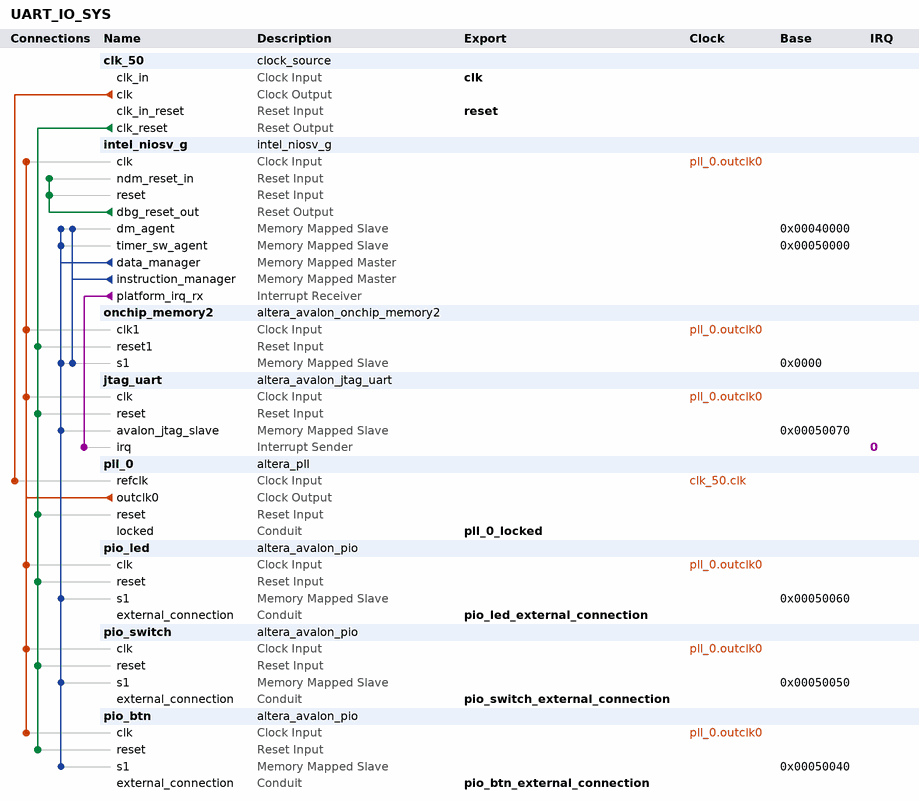
[diagram p0: system contents]
# Platform Designer (Qsys) system UART_IO_SYS, Cyclone V 5CSEBA6U23I7
# Parameters at their usual value, and those the tool derives, are not listed.
package require -exact qsys 25.1
create_system UART_IO_SYS
set_project_property DEVICE_FAMILY {Cyclone V}
set_project_property DEVICE 5CSEBA6U23I7

add_instance clk_50 clock_source 25.1
set_instance_parameter_value clk_50 clockFrequency 50000000

add_instance intel_niosv_g intel_niosv_g 4.0.0
set_instance_parameter_value intel_niosv_g Blind_Window_Period 1000
set_instance_parameter_value intel_niosv_g CLICenabledInterruptMode 0
set_instance_parameter_value intel_niosv_g CLICenabledShadowRegisterFiles 1
set_instance_parameter_value intel_niosv_g Default_Timeout_Period 255
set_instance_parameter_value intel_niosv_g alignCLICVectorTable 8
set_instance_parameter_value intel_niosv_g basicInterruptMode 0
set_instance_parameter_value intel_niosv_g basicShadowRegisterFiles 0
set_instance_parameter_value intel_niosv_g clockFrequency 100000000
set_instance_parameter_value intel_niosv_g dataCacheSize 4096
set_instance_parameter_value intel_niosv_g disableFsqrtFdiv false
set_instance_parameter_value intel_niosv_g dtcm1Base 0
set_instance_parameter_value intel_niosv_g dtcm1Size 0
set_instance_parameter_value intel_niosv_g dtcm2Base 0
set_instance_parameter_value intel_niosv_g dtcm2Size 0
set_instance_parameter_value intel_niosv_g enableBranchPrediction true
set_instance_parameter_value intel_niosv_g enableCLICInterruptEdgeTriggerConfig false
set_instance_parameter_value intel_niosv_g enableCLICInterruptPolarityConfig false
set_instance_parameter_value intel_niosv_g enableCLICSelectiveHardwareVectoring false
set_instance_parameter_value intel_niosv_g enableCoreLevelInterruptController false
set_instance_parameter_value intel_niosv_g enableDebug true
set_instance_parameter_value intel_niosv_g enableDebugReset true
set_instance_parameter_value intel_niosv_g enableECCFull false
set_instance_parameter_value intel_niosv_g enableECCLite false
set_instance_parameter_value intel_niosv_g enableFPU false
set_instance_parameter_value intel_niosv_g enableLockstep false
set_instance_parameter_value intel_niosv_g enableLockstepExtRst false
set_instance_parameter_value intel_niosv_g enableMulDiv true
set_instance_parameter_value intel_niosv_g hartId 0
set_instance_parameter_value intel_niosv_g instCacheSize 4096
set_instance_parameter_value intel_niosv_g itcm1Base 0
set_instance_parameter_value intel_niosv_g itcm1Size 0
set_instance_parameter_value intel_niosv_g itcm2Base 0
set_instance_parameter_value intel_niosv_g itcm2Size 0
set_instance_parameter_value intel_niosv_g numCLICDebugTriggers 0
set_instance_parameter_value intel_niosv_g numCLICLevels 2
set_instance_parameter_value intel_niosv_g numCLICPlatformInterrupts 16
set_instance_parameter_value intel_niosv_g numCLICPriorities 8
set_instance_parameter_value intel_niosv_g peripheralRegionABase 327680
set_instance_parameter_value intel_niosv_g peripheralRegionASize 65536
set_instance_parameter_value intel_niosv_g peripheralRegionBBase 0
set_instance_parameter_value intel_niosv_g peripheralRegionBSize 0
set_instance_parameter_value intel_niosv_g resetOffset 0
set_instance_parameter_value intel_niosv_g resetSlave onchip_memory2.s1
set_instance_parameter_value intel_niosv_g useResetReq false

add_instance onchip_memory2 altera_avalon_onchip_memory2 25.1
set_instance_parameter_value onchip_memory2 dataWidth 32
set_instance_parameter_value onchip_memory2 dualPort false
set_instance_parameter_value onchip_memory2 initMemContent true
set_instance_parameter_value onchip_memory2 initializationFileName onchip_mem.hex
set_instance_parameter_value onchip_memory2 memorySize 160000

add_instance jtag_uart altera_avalon_jtag_uart 25.1
set_instance_parameter_value jtag_uart simInteractiveOptions NO_INTERACTIVE_WINDOWS

add_instance pll_0 altera_pll 25.1
set_instance_parameter_value pll_0 gui_device_speed_grade 1
set_instance_parameter_value pll_0 gui_number_of_clocks 1
set_instance_parameter_value pll_0 gui_operation_mode direct
set_instance_parameter_value pll_0 gui_output_clock_frequency0 100.0
set_instance_parameter_value pll_0 gui_pll_mode {Integer-N PLL}
set_instance_parameter_value pll_0 gui_reference_clock_frequency 50.0
set_instance_parameter_value pll_0 gui_use_locked true

add_instance pio_led altera_avalon_pio 25.1
set_instance_parameter_value pio_led direction Output
set_instance_parameter_value pio_led width 8

add_instance pio_switch altera_avalon_pio 25.1
set_instance_parameter_value pio_switch direction Input
set_instance_parameter_value pio_switch width 3

add_instance pio_btn altera_avalon_pio 25.1
set_instance_parameter_value pio_btn direction Input
set_instance_parameter_value pio_btn width 2

# connections
add_connection clk_50.clk pll_0.refclk clock
add_connection pll_0.outclk0 intel_niosv_g.clk clock
add_connection pll_0.outclk0 jtag_uart.clk clock
add_connection pll_0.outclk0 onchip_memory2.clk1 clock
add_connection pll_0.outclk0 pio_btn.clk clock
add_connection pll_0.outclk0 pio_led.clk clock
add_connection pll_0.outclk0 pio_switch.clk clock
add_connection clk_50.clk_reset jtag_uart.reset reset
add_connection clk_50.clk_reset onchip_memory2.reset1 reset
add_connection clk_50.clk_reset pio_btn.reset reset
add_connection clk_50.clk_reset pio_led.reset reset
add_connection clk_50.clk_reset pio_switch.reset reset
add_connection clk_50.clk_reset pll_0.reset reset
add_connection intel_niosv_g.dbg_reset_out intel_niosv_g.ndm_reset_in reset
add_connection intel_niosv_g.dbg_reset_out intel_niosv_g.reset reset
add_connection intel_niosv_g.data_manager intel_niosv_g.dm_agent avalon
set_connection_parameter_value intel_niosv_g.data_manager/intel_niosv_g.dm_agent baseAddress 0x00040000
add_connection intel_niosv_g.data_manager intel_niosv_g.timer_sw_agent avalon
set_connection_parameter_value intel_niosv_g.data_manager/intel_niosv_g.timer_sw_agent baseAddress 0x00050000
add_connection intel_niosv_g.data_manager jtag_uart.avalon_jtag_slave avalon
set_connection_parameter_value intel_niosv_g.data_manager/jtag_uart.avalon_jtag_slave baseAddress 0x00050070
add_connection intel_niosv_g.data_manager onchip_memory2.s1 avalon
set_connection_parameter_value intel_niosv_g.data_manager/onchip_memory2.s1 baseAddress 0x0000
add_connection intel_niosv_g.data_manager pio_btn.s1 avalon
set_connection_parameter_value intel_niosv_g.data_manager/pio_btn.s1 baseAddress 0x00050040
add_connection intel_niosv_g.data_manager pio_led.s1 avalon
set_connection_parameter_value intel_niosv_g.data_manager/pio_led.s1 baseAddress 0x00050060
add_connection intel_niosv_g.data_manager pio_switch.s1 avalon
set_connection_parameter_value intel_niosv_g.data_manager/pio_switch.s1 baseAddress 0x00050050
add_connection intel_niosv_g.instruction_manager intel_niosv_g.dm_agent avalon
set_connection_parameter_value intel_niosv_g.instruction_manager/intel_niosv_g.dm_agent baseAddress 0x00040000
add_connection intel_niosv_g.instruction_manager onchip_memory2.s1 avalon
set_connection_parameter_value intel_niosv_g.instruction_manager/onchip_memory2.s1 baseAddress 0x0000
add_connection intel_niosv_g.platform_irq_rx jtag_uart.irq interrupt
set_connection_parameter_value intel_niosv_g.platform_irq_rx/jtag_uart.irq irqNumber 0

# exported interfaces
add_interface clk clock sink
set_interface_property clk EXPORT_OF clk_50.clk_in
add_interface pio_btn_external_connection conduit end
set_interface_property pio_btn_external_connection EXPORT_OF pio_btn.external_connection
add_interface pio_led_external_connection conduit end
set_interface_property pio_led_external_connection EXPORT_OF pio_led.external_connection
add_interface pio_switch_external_connection conduit end
set_interface_property pio_switch_external_connection EXPORT_OF pio_switch.external_connection
add_interface pll_0_locked conduit end
set_interface_property pll_0_locked EXPORT_OF pll_0.locked
add_interface reset reset sink
set_interface_property reset EXPORT_OF clk_50.clk_in_reset

set_interconnect_requirement {$system} qsys_mm.clockCrossingAdapter HANDSHAKE
set_interconnect_requirement {$system} qsys_mm.enableEccProtection FALSE
set_interconnect_requirement {$system} qsys_mm.insertDefaultSlave FALSE
set_interconnect_requirement {$system} qsys_mm.maxAdditionalLatency 1

save_system UART_IO_SYS.qsys
